# Altium schematic sheet J201M1.SchDoc
size A4; SheetNumber: 6; SheetTotal: 6
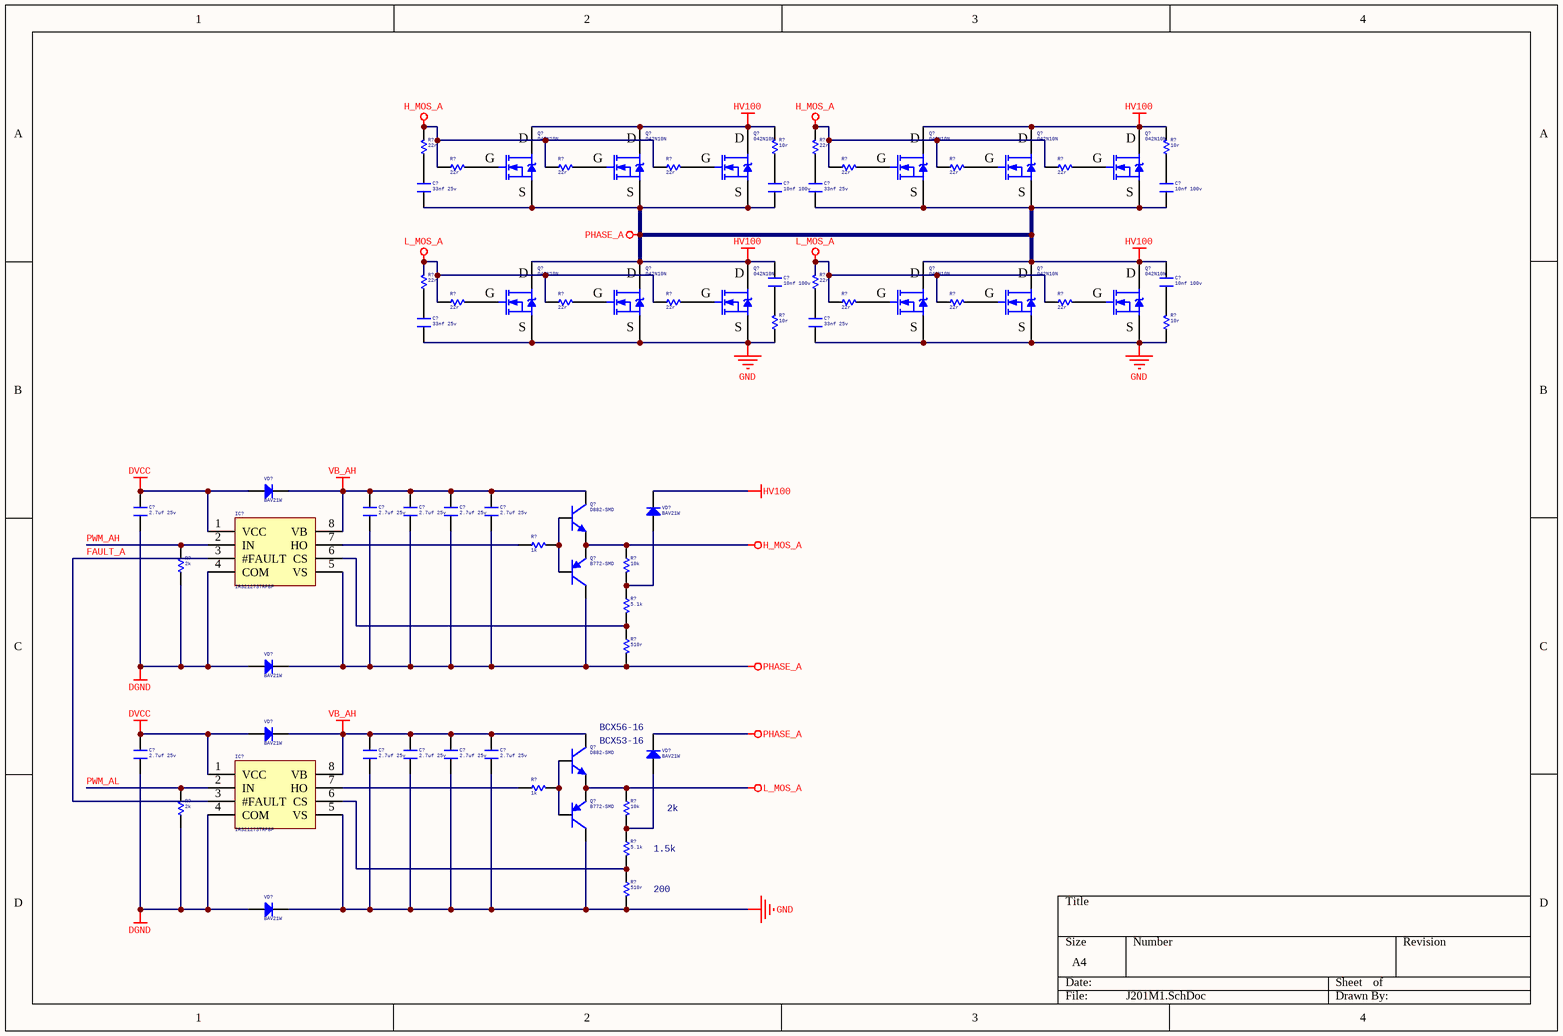
[diagram p0: J201M1.SchDoc]

## Parts
(Parts that share a designator on the sheet are numbered #1, #2 ... from top to bottom, then left to right.)
C?#1  33nf 25v  [C 0805]
C?#2  10nf 100v  [C 0805]
C?#3  33nf 25v  [C 0805]
C?#4  10nf 100v  [C 0805]
C?#5  10nf 100v  [C 0805]
C?#6  10nf 100v  [C 0805]
C?#7  33nf 25v  [C 0805]
C?#8  33nf 25v  [C 0805]
C?#9  2.7uf 25v  [C 0805]
C?#10  2.7uf 25v  [C 0805]
C?#11  2.7uf 25v  [C 0805]
C?#12  2.7uf 25v  [C 0805]
C?#13  2.7uf 25v  [C 0805]
C?#14  2.7uf 25v  [C 0805]
C?#15  2.7uf 25v  [C 0805]
C?#16  2.7uf 25v  [C 0805]
C?#17  2.7uf 25v  [C 0805]
C?#18  2.7uf 25v  [C 0805]
IC?#1  IRS2127STRPBF  [SOP8_N]
IC?#2  IRS2127STRPBF  [SOP8_N]
Q?#1  042N10N  [TO263-3B]
Q?#2  042N10N  [TO263-3B]
Q?#3  042N10N  [TO263-3B]
Q?#4  042N10N  [TO263-3B]
Q?#5  042N10N  [TO263-3B]
Q?#6  042N10N  [TO263-3B]
Q?#7  042N10N  [TO263-3B]
Q?#8  042N10N  [TO263-3B]
Q?#9  042N10N  [TO263-3B]
Q?#10  042N10N  [TO263-3B]
Q?#11  042N10N  [TO263-3B]
Q?#12  042N10N  [TO263-3B]
Q?#13  D882-SMD  [SOT89_N]
Q?#14  B772-SMD  [SOT89_N]
Q?#15  D882-SMD  [SOT89_N]
Q?#16  B772-SMD  [SOT89_N]
R?#1  10r  [R 1210]
R?#2  10r  [R 1210]
R?#3  22r  [R 0805]
R?#4  22r  [R 0805]
R?#5  22r  [R 0805]
R?#6  22r  [R 0805]
R?#7  22r  [R 0805]
R?#8  22r  [R 0805]
R?#9  22r  [R 0805]
R?#10  22r  [R 0805]
R?#11  22r  [R 0805]
R?#12  22r  [R 0805]
R?#13  22r  [R 0805]
R?#14  22r  [R 0805]
R?#15  22r  [R 0805]
R?#16  22r  [R 0805]
R?#17  22r  [R 0805]
R?#18  22r  [R 0805]
R?#19  10r  [R 1210]
R?#20  10r  [R 1210]
R?#21  2k  [R 0805]
R?#22  1k  [R 0805]
R?#23  10k  [R 0805]
R?#24  5.1k  [R 0805]
R?#25  510r  [R 0805]
R?#26  2k  [R 0805]
R?#27  1k  [R 0805]
R?#28  10k  [R 0805]
R?#29  5.1k  [R 0805]
R?#30  510r  [R 0805]
VD?#1  BAV21W  [SOD-123]
VD?#2  BAV21W  [SOD-123]
VD?#3  BAV21W  [SOD-123]
VD?#4  BAV21W  [SOD-123]
VD?#5  BAV21W  [SOD-123]
VD?#6  BAV21W  [SOD-123]

## Nets
DGND: C?#9.1 C?#14.1 IC?#1.4(COM) IC?#2.4(COM) R?#21.2 R?#26.2 VD?#3.1(A) VD?#6.1(A)
DVCC: C?#9.2 C?#14.2 IC?#1.1(VCC) IC?#2.1(VCC) VD?#1.1(A) VD?#4.1(A)
GND: C?#7.1 C?#8.1 C?#15.1 C?#16.1 C?#17.1 C?#18.1 IC?#2.5(VS) Q?#7.3(S) Q?#8.3(S) Q?#9.3(S) Q?#10.3(S) Q?#11.3(S) Q?#12.3(S) Q?#16.2(C) R?#19.1 R?#20.1 R?#30.2 VD?#6.2(K)
H_MOS_A: Q?#13.3(E) Q?#14.3(E) R?#3.2 R?#4.1 R?#5.1 R?#6.1 R?#7.2 R?#8.1 R?#9.1 R?#10.1 R?#23.1
HV100: C?#1.1 C?#2.1 C?#3.1 C?#4.1 C?#5.1 C?#6.1 C?#10.1 C?#11.1 C?#12.1 C?#13.1 IC?#1.5(VS) Q?#1.2(D) Q?#1.3(S) Q?#2.2(D) Q?#2.3(S) Q?#3.2(D) Q?#3.3(S) Q?#4.2(D) Q?#4.3(S) Q?#5.2(D) Q?#5.3(S) Q?#6.2(D) Q?#6.3(S) Q?#7.2(D) Q?#8.2(D) Q?#9.2(D) Q?#10.2(D) Q?#11.2(D) Q?#12.2(D) Q?#14.2(C) R?#1.1 R?#2.1 R?#25.2 VD?#2.2(K) VD?#3.2(K) VD?#5.2(K)  [also labelled PHASE_A]
L_MOS_A: Q?#15.3(E) Q?#16.3(E) R?#11.2 R?#12.1 R?#13.1 R?#14.1 R?#15.2 R?#16.1 R?#17.1 R?#18.1 R?#28.1
VB_AH: C?#10.2 C?#11.2 C?#12.2 C?#13.2 C?#15.2 C?#16.2 C?#17.2 C?#18.2 IC?#1.8(VB) IC?#2.8(VB) Q?#13.2(C) Q?#15.2(C) VD?#1.2(K) VD?#4.2(K)
FAULT_A: IC?#1.3(#FAULT) IC?#2.3(#FAULT)
PWM_AH: IC?#1.2(IN) R?#21.1
PWM_AL: IC?#2.2(IN) R?#26.1
NetC?#1_2: C?#1.2 R?#3.1
NetC?#2_2: C?#2.2 R?#1.2
NetC?#3_2: C?#3.2 R?#7.1
NetC?#4_2: C?#4.2 R?#2.2
NetC?#5_2: C?#5.2 R?#19.2
NetC?#6_2: C?#6.2 R?#20.2
NetC?#7_2: C?#7.2 R?#11.1
NetC?#8_2: C?#8.2 R?#15.1
NetIC?#1_6: IC?#1.6(CS) R?#24.2 R?#25.1
NetIC?#1_7: IC?#1.7(HO) R?#22.2
NetIC?#2_6: IC?#2.6(CS) R?#29.2 R?#30.1
NetIC?#2_7: IC?#2.7(HO) R?#27.2
NetQ?#1_1: Q?#1.1(G) R?#4.2
NetQ?#2_1: Q?#2.1(G) R?#5.2
NetQ?#3_1: Q?#3.1(G) R?#6.2
NetQ?#4_1: Q?#4.1(G) R?#8.2
NetQ?#5_1: Q?#5.1(G) R?#9.2
NetQ?#6_1: Q?#6.1(G) R?#10.2
NetQ?#7_1: Q?#7.1(G) R?#12.2
NetQ?#8_1: Q?#8.1(G) R?#13.2
NetQ?#9_1: Q?#9.1(G) R?#14.2
NetQ?#10_1: Q?#10.1(G) R?#16.2
NetQ?#11_1: Q?#11.1(G) R?#17.2
NetQ?#12_1: Q?#12.1(G) R?#18.2
NetQ?#13_1: Q?#13.1(B) Q?#14.1(B) R?#22.1
NetQ?#15_1: Q?#15.1(B) Q?#16.1(B) R?#27.1
NetR?#23_2: R?#23.2 R?#24.1 VD?#2.1(A)
NetR?#28_2: R?#28.2 R?#29.1 VD?#5.1(A)

## Notes on the sheet
- BCX56-16
- BCX53-16
- (near R?#29) 1.5k
- 2k
- (near R?#30) 200

## Library data of the parts
C?#1-C?#18 = C: 无极性贴片电容
  C?#1 C?#3 C?#7 C?#8: Voltage: 25v; Value: 33nf
  C?#2 C?#4-C?#6: Voltage: 100v; Value: 10nf
  C?#9-C?#18: Voltage: 25v; Value: 2.7uf
IC?#1 IC?#2 = IRS2127: 12V~20V 600mA/290mA高端驱动器
Q?#1-Q?#12 = P40NF10L: N沟场效应管
Q?#13 Q?#15 = D882-SMD: 音频功放-NPN型
Q?#14 Q?#16 = B772-SMD: 音频功放-PNP型
R?#1-R?#30 = R: 贴片电阻
  R?#1 R?#2 R?#19 R?#20: Value: 10r
  R?#3-R?#18: Value: 22r
  R?#21 R?#26: Value: 2k
  R?#22 R?#27: Value: 1k
  R?#23 R?#28: Value: 10k
  R?#24 R?#29: Value: 5.1k
  R?#25 R?#30: Value: 510r
VD?#1-VD?#6 = 1N4007: 整流二极管